# Altium schematic sheet pca20017_motors.SchDoc: nRF52 Quadcopter - Motors
size A4; Organization: Nordic Semiconductor; DocumentNumber: 5; Revision: 1.0.0; SheetNumber: 5; SheetTotal: 5; CompanyName: Nordic Semiconductor; DrawnBy: ERHE; ProjectNumber: 4425; DocumentSize: A4; PCAName: PCA20017; PCBRevision: 0002ERHE; PCBNumber: 400151
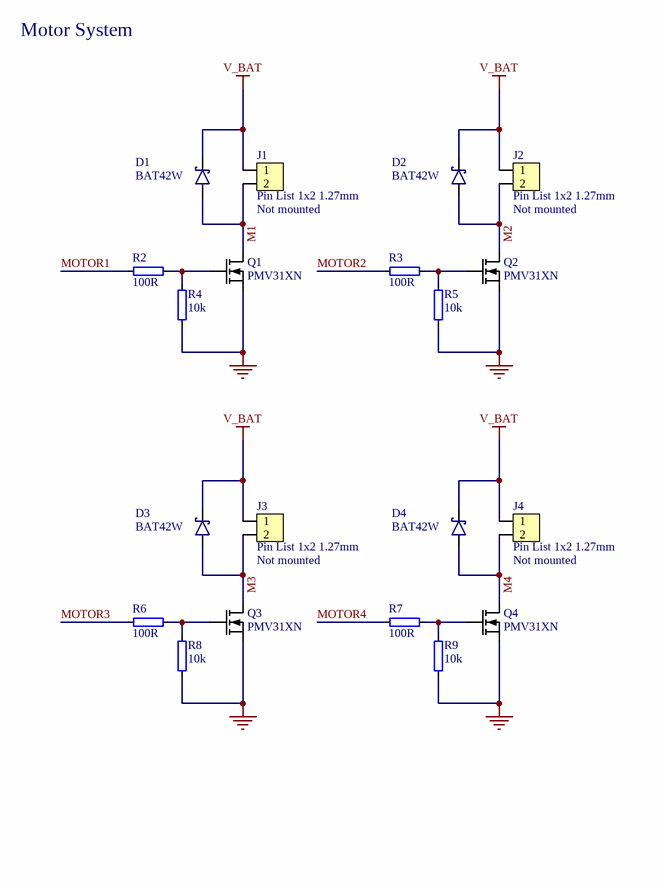
[diagram p0: pca20017_motors.SchDoc]

## Parts
D1  BAT42W  [SOD-123]
D2  BAT42W  [SOD-123]
D3  BAT42W  [SOD-123]
D4  BAT42W  [SOD-123]
J1  Pin List 1x2 1.27mm  Assembly: Not mounted  [LIST_1x2_TH_1.27mm_N.C.]
J2  Pin List 1x2 1.27mm  Assembly: Not mounted  [LIST_1x2_TH_1.27mm_N.C.]
J3  Pin List 1x2 1.27mm  Assembly: Not mounted  [LIST_1x2_TH_1.27mm_N.C.]
J4  Pin List 1x2 1.27mm  Assembly: Not mounted  [LIST_1x2_TH_1.27mm_N.C.]
Q1  PMV31XN  [SOT-23a]
Q2  PMV31XN  [SOT-23a]
Q3  PMV31XN  [SOT-23a]
Q4  PMV31XN  [SOT-23a]
R2  100R  [RESC1005X04L]
R3  100R  [RESC1005X04L]
R4  10k  [RESC1005X04L]
R5  10k  [RESC1005X04L]
R6  100R  [RESC1005X04L]
R7  100R  [RESC1005X04L]
R8  10k  [RESC1005X04L]
R9  10k  [RESC1005X04L]

## Nets
GND: Q1.2(S) Q2.2(S) Q3.2(S) Q4.2(S) R4.1 R5.1 R8.1 R9.1
V_BAT: D1.3(C) D2.3(C) D3.3(C) D4.3(C) J1.1 J2.1 J3.1 J4.1
M1: D1.1(A) J1.2 Q1.3(D)
M2: D2.1(A) J2.2 Q2.3(D)
M3: D3.1(A) J3.2 Q3.3(D)
M4: D4.1(A) J4.2 Q4.3(D)
MOTOR1: R2.1
MOTOR2: R3.1
MOTOR3: R6.1
MOTOR4: R7.1
NetQ1_1: Q1.1(G) R2.2 R4.2
NetQ2_1: Q2.1(G) R3.2 R5.2
NetQ3_1: Q3.1(G) R6.2 R8.2
NetQ4_1: Q4.1(G) R7.2 R9.2

## Notes on the sheet
- Motor System
- Title
- Size
- Date:
- Project Number
- Sheet         of
- Revision
- File:
- Drawn By:

## Library data of the parts
D1-D4 = BAT42W: Diode Schottky, Vr=30V, If=200mA, Vf=400mV, SOD-123; Manufacturer: Multicomp; Artikkelnr Noca: 10029103; Artikkelnr Simpro: N.A.; Part Number: BAT42W; Manufacturer Part Number: BAT42W; Datasheet: http://www.farnell.com/datasheets/62636.pdf; Footprint Doc: SOD-123; LatestRevisionDate: 2011-10-10; Pin Count: 2; Publisher: Nordic Semiconductor; Published: 2011-10-10; Value: BAT42W; Note: Diode; Supplier: Farnell; Supplier part number: 162-1829; 2nd source Supplier: *; 2nd source part number: *
J1-J4 = Pin List 1x2 TH, 1.27mm, N.C.: Pin List 1x2, 1.27mm (50mil), N.C.; Artikkelnr Noca: N.A.; Part Number: Pin List 1x2 TH, 1.27mm, N.C.; Manufacturer: *; Manufacturer Part Number: *; Datasheet: *; Footprint Doc: LIST_1x2_TH_1.27mm_N.C.; LatestRevisionDate: 2015-07-03; Pin Count: 2; Publisher: Nordic Semiconductor; Published: 2015-06-26; Value: Pin List 1x2 1.27mm; Note: *; Supplier: *; Supplier part number: *; 2nd source Supplier: *; 2nd source part number: *; Artikkelnr Simpro: N.A.
Q1-Q4 = PMV31XN: N-channel TrenchMOS FET; Manufacturer: NXP; 2nd source part number: 1081481RL; Note: 20V; Artikkelnr Noca: N.A.; Part Number: PMV31XN; Manufacturer Part Number: PMV31XN; Datasheet: http://www.nxp.com/documents/data_sheet/PMV31XN.pdf; Footprint Doc: SOT23; LatestRevisionDate: 2015-06-24; Publisher: Nordic Semiconductor; Published: 2015-06-24; Value: PMV31XN; Supplier: Digi-Key; Supplier part number: 568-2354-2-ND; 2nd source Supplier: Farnell; Artikkelnr Simpro: N.A.
R2 R3 R6 R7 = R0402-100: Resistor, ±1%, 0.063W; Note: Chip Res 1%; Artikkelnr Noca: 27049049; Artikkelnr Simpro: N.A.; Value Ohm: 100; Part Number: R0402-100; Manufacturer: *; Manufacturer Part Number: *; Datasheet: *; Footprint Doc: 0402; LatestRevisionDate: 2009-11-23; Pin Count: 2; Publisher: Nordic Semiconductor; Published: 2009-05-08; Value: 100R; Supplier: Farnell; Supplier part number: 173-8837; 2nd source Supplier: *; 2nd source part number: *
R4 R5 R8 R9 = R0402-10k: Resistor, ±1%, 0.063W; Note: Chip Res 1%; Artikkelnr Noca: 27049097; Artikkelnr Simpro: N.A.; Value Ohm: 10000; Part Number: R0402-10k; Manufacturer: *; Manufacturer Part Number: *; Datasheet: *; Footprint Doc: 0402; LatestRevisionDate: 2009-11-23; Pin Count: 2; Publisher: Nordic Semiconductor; Published: 2009-05-08; Value: 10k; Supplier: Farnell; Supplier part number: 173-8864; 2nd source Supplier: *; 2nd source part number: *